# EasyEDA schematic SCH_CH32V003EasyUSBBoard_SCH_2024-02-12.json
TITLE: CH32V003EasyUSBBoard; REV: 1.0; Date: 2024-02-04; Sheet: 1/1; Drawn By: chaealarm; Company: Individual
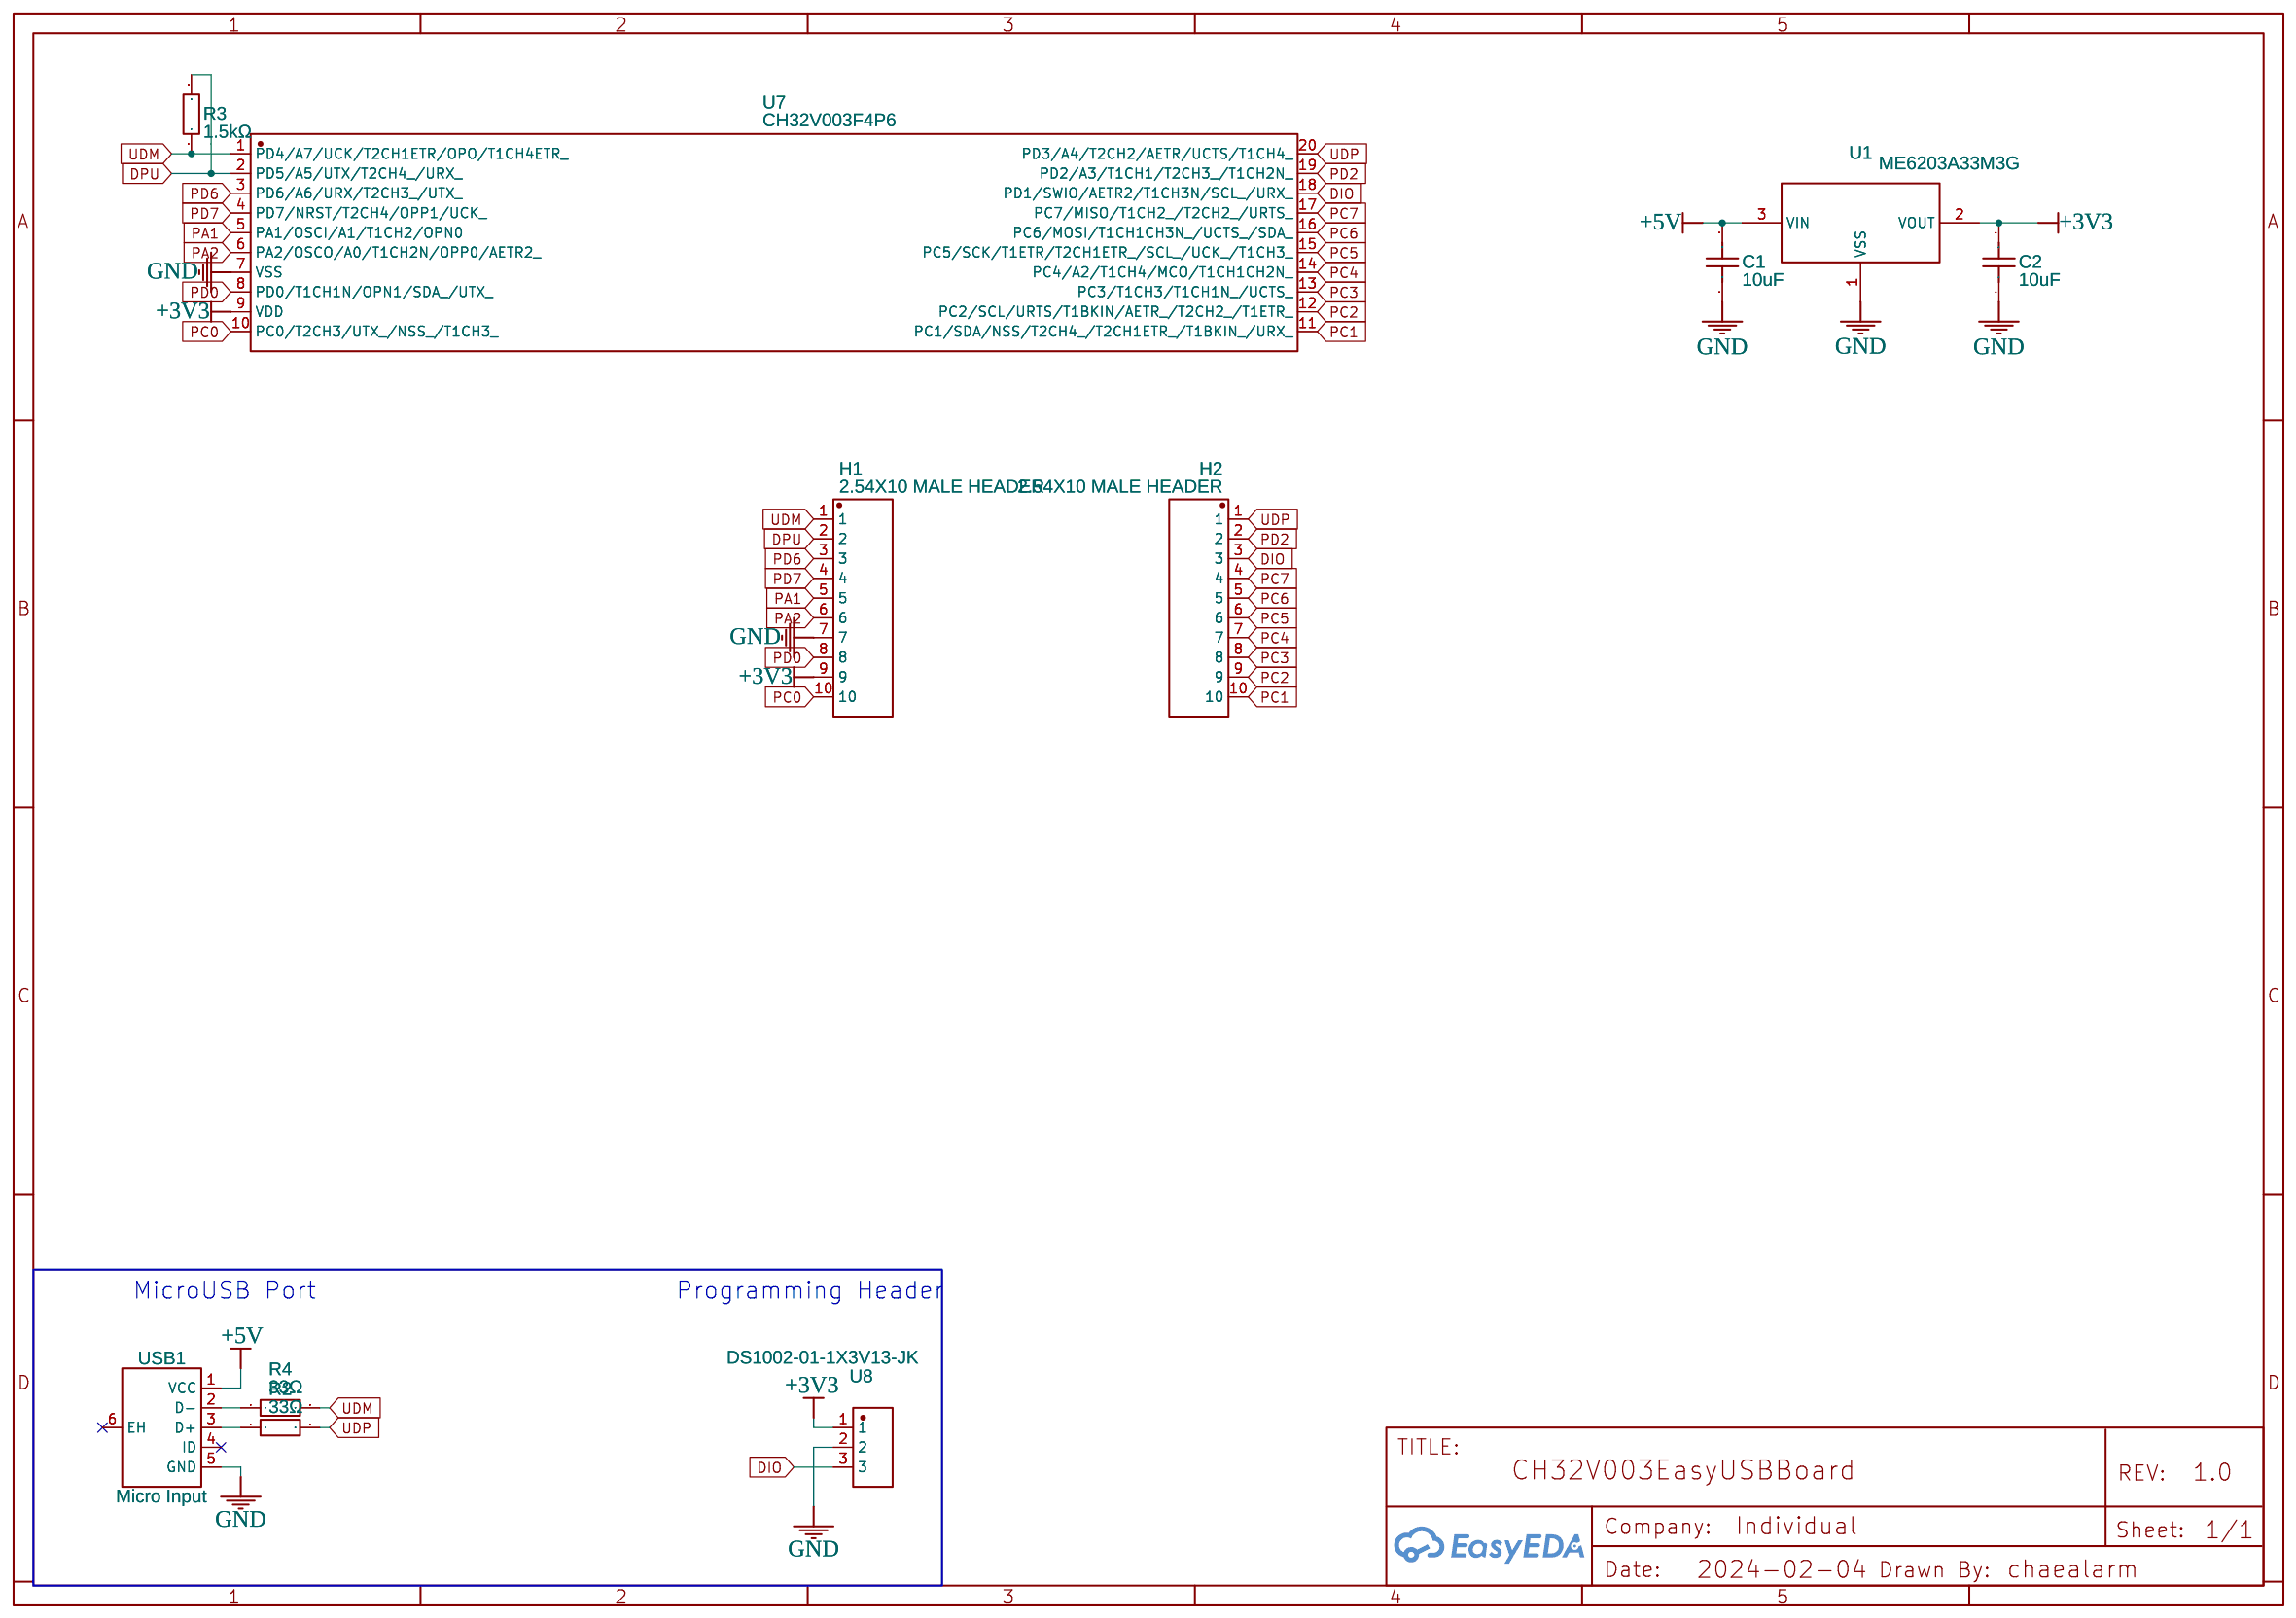
[diagram p0: schematic sheet]

## Parts
C1  10uF  [C0603]
C2  10uF  [C0603]
H1  2.54X10 MALE HEADER  [1X10P-2.54 MALE]
H2  2.54X10 MALE HEADER  [1X10P-2.54 MALE]
R2  33Ω  [R0603]
R3  1.5kΩ  [R0603]
R4  33Ω  [R0603]
U1  ME6203A33M3G  [SOT-23-3_L2.9-W1.3-P1.90-LS2.4-BR]
U7  CH32V003F4P6  [TSSOP-20_L6.5-W4.4-P0.65-LS6.4-BL]
U8  DS1002-01-1X3V13-JK  [HDR-TH_3P-P2.54-V-M-1]
USB1  Micro Input  [MINI-USB-SMD_U254-051T-4BH23-S2B]

## Library data of the parts
C1 C2 = CL10A106KP8NNNC: Supplier: LCSC; Manufacturer: SAMSUNG(三星); Supplier Part: C19702; JLCPCB Part Class: Basic Part
H1 H2 = 2.54X10 MALE HEADER: Supplier: LCSC; Manufacturer: Ckmtw; Manufacturer Part: 210S-1*11P L=11.6MMGold-plated black; Contributor: DND TSI; Supplier Part: C124372
R2 R4 = 0603WAF330JT5E: Supplier: LCSC; Manufacturer: UNI-ROYAL(厚声); Supplier Part: C23140; JLCPCB Part Class: Basic Part
R3 = 0603WAF1501T5E: Supplier: LCSC; Manufacturer: UNI-ROYAL(厚声); Supplier Part: C22843; JLCPCB Part Class: Basic Part
U1 = ME6203A33M3G: Supplier: LCSC; Manufacturer: MICRONE(南京微盟); Supplier Part: C87842; JLCPCB Part Class: Extended Part
U7 = CH32V003F4P6: Contributor: lcsc; Supplier: LCSC; Supplier Part: C5187096; Manufacturer: null; JLCPCB Part Class: Extended Part
U8 = DS1002-01-1X3V13-JK: Supplier: LCSC; Supplier Part: C7495228; Manufacturer: CONNFLY; Manufacturer Part: DS1002-01-1x3V13-JK; Contributor: lcsc
USB1 = U254-051T-4BH23-S2B: Supplier: LCSC; Supplier Part: C319164; Manufacturer: XKB Enterprise; Contributor: LCSC; JLCPCB Part Class: Extended Part

## Nets
+3V3: C2.2 H1.9 U1.2(VOUT) U7.9(VDD) U8.1
+5V: C1.2 U1.3(VIN) USB1.1(VCC)
GND: C1.1 C2.1 H1.7 U1.1(VSS) U7.7(VSS) U8.2 USB1.5(GND)
DIO: H2.3 U7.18(PD1/SWIO/AETR2/T1CH3N/SCL_/URX_) U8.3
DPU: H1.2 R3.2 U7.2(PD5/A5/UTX/T2CH4_/URX_)
PA1: H1.5 U7.5(PA1/OSCI/A1/T1CH2/OPN0)
PA2: H1.6 U7.6(PA2/OSCO/A0/T1CH2N/OPP0/AETR2_)
PC0: H1.10 U7.10(PC0/T2CH3/UTX_/NSS_/T1CH3_)
PC1: H2.10 U7.11(PC1/SDA/NSS/T2CH4_/T2CH1ETR_/T1BKIN_/URX_)
PC2: H2.9 U7.12(PC2/SCL/URTS/T1BKIN/AETR_/T2CH2_/T1ETR_)
PC3: H2.8 U7.13(PC3/T1CH3/T1CH1N_/UCTS_)
PC4: H2.7 U7.14(PC4/A2/T1CH4/MCO/T1CH1CH2N_)
PC5: H2.6 U7.15(PC5/SCK/T1ETR/T2CH1ETR_/SCL_/UCK_/T1CH3_)
PC6: H2.5 U7.16(PC6/MOSI/T1CH1CH3N_/UCTS_/SDA_)
PC7: H2.4 U7.17(PC7/MISO/T1CH2_/T2CH2_/URTS_)
PD0: H1.8 U7.8(PD0/T1CH1N/OPN1/SDA_/UTX_)
PD2: H2.2 U7.19(PD2/A3/T1CH1/T2CH3_/T1CH2N_)
PD6: H1.3 U7.3(PD6/A6/URX/T2CH3_/UTX_)
PD7: H1.4 U7.4(PD7/NRST/T2CH4/OPP1/UCK_)
UDM: H1.1 R3.1 R4.2 U7.1(PD4/A7/UCK/T2CH1ETR/OPO/T1CH4ETR_)
UDP: H2.1 R2.2 U7.20(PD3/A4/T2CH2/AETR/UCTS/T1CH4_)
Net-(R2-1): R2.1 USB1.3(D+)
Net-(R4-1): R4.1 USB1.2(D-)

Not connected (* = marked no-connect by the designer): USB1 4(ID)* 6(EH)*

## Notes on the sheet
- MicroUSB Port
- Programming Header
